# Altium project discovery_shield.PrjPcb
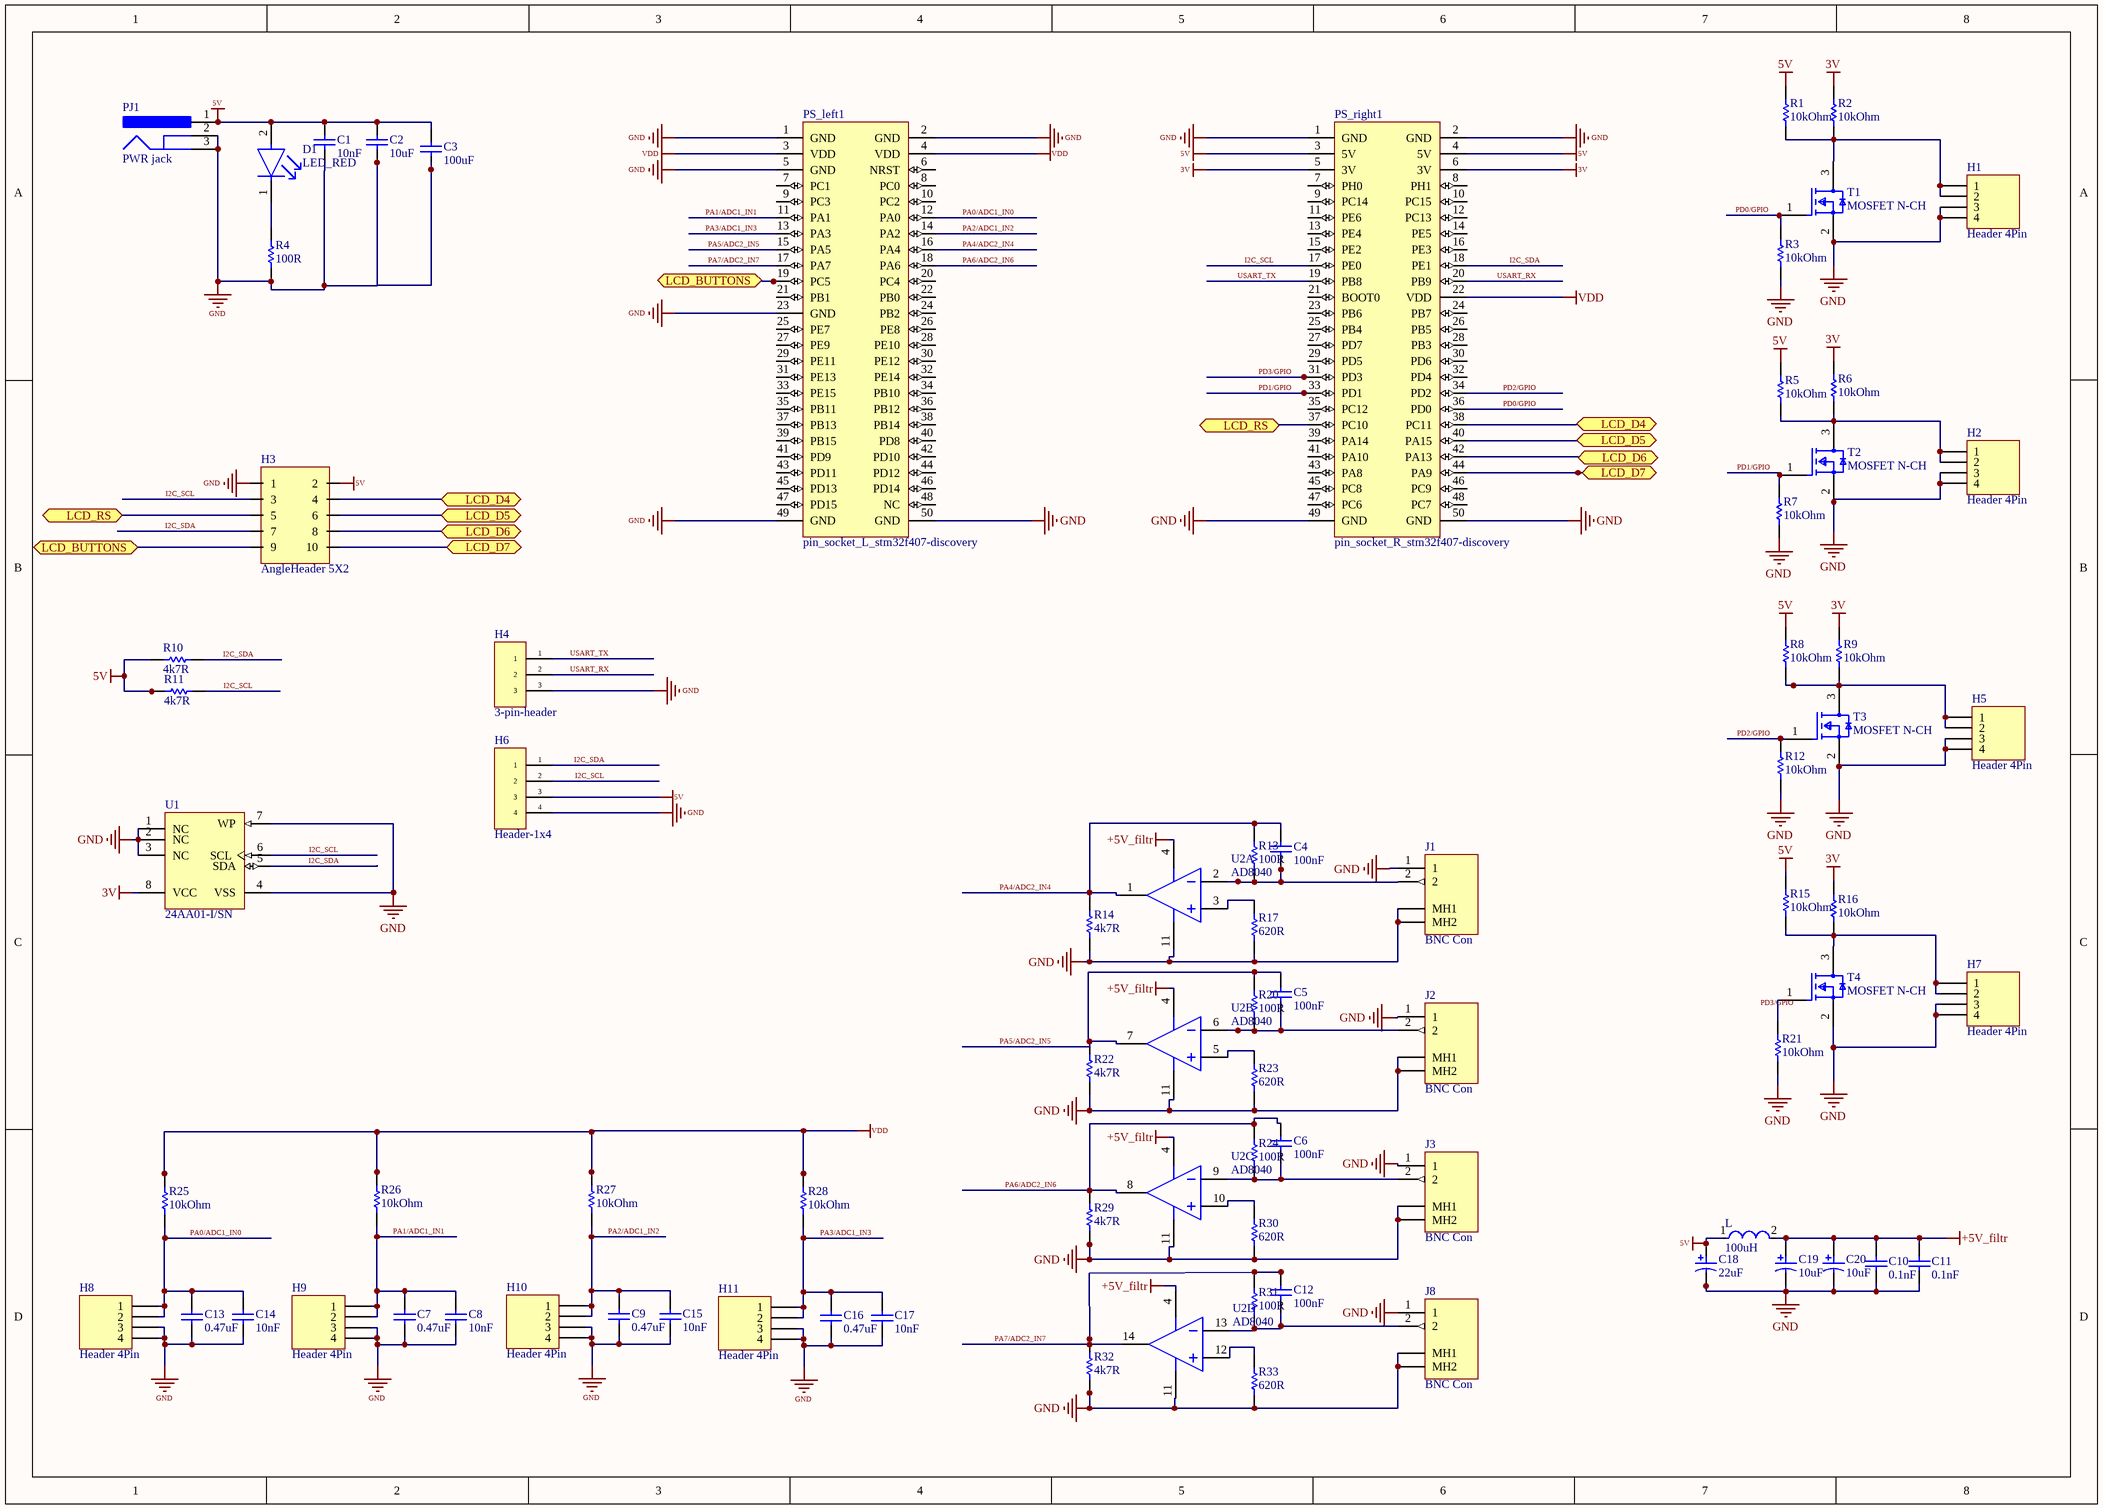
[diagram p0: discovery_shield.SchDoc]
1 sheet, 77 parts. Net scope: flat (ports and power ports of the same name join across sheets).
Board file: discovery_shield.PcbDoc

## Sheet discovery_shield.SchDoc
size A3

### Parts
C1  10nF  [CHIP CAPACITOR 0805]
C2  10uF  [CHIP CAPACITOR 0805]
C3  100uF  [CHIP CAPACITOR 0805]
C4  100nF  [CHIP CAPACITOR 0805]
C5  100nF  [CHIP CAPACITOR 0805]
C6  100nF  [CHIP CAPACITOR 0805]
C7  0.47uF  [CHIP CAPACITOR 0805]
C8  10nF  [CHIP CAPACITOR 0805]
C9  0.47uF  [CHIP CAPACITOR 0805]
C10  0.1nF  [CAP-CER-0.1nF]
C11  0.1nF  [CAP-CER-0.1nF]
C12  100nF  [CHIP CAPACITOR 0805]
C13  0.47uF  [CHIP CAPACITOR 0805]
C14  10nF  [CHIP CAPACITOR 0805]
C15  10nF  [CHIP CAPACITOR 0805]
C16  0.47uF  [CHIP CAPACITOR 0805]
C17  10nF  [CHIP CAPACITOR 0805]
C18  22uF  [TANTALUM_CAP_10uF]
C19  10uF  [TANTALUM_CAP_10uF]
C20  10uF  [TANTALUM_CAP_10uF]
D1  LED_RED  [LED 0805 RED]
H1  Header 4Pin  [CRIMP 3mm  4 pins]
H2  Header 4Pin  [CRIMP 3mm  4 pins]
H3  AngleHeader 5X2  [AngleHeader 5X2]
H4  3-pin-header  [Header-3-Pin]
H5  Header 4Pin  [CRIMP 3mm  4 pins]
H6  Header-1x4  [Header-1x4]
H7  Header 4Pin  [CRIMP 3mm  4 pins]
H8  Header 4Pin  [CRIMP 3mm  4 pins]
H9  Header 4Pin  [CRIMP 3mm  4 pins]
H10  Header 4Pin  [CRIMP 3mm  4 pins]
H11  Header 4Pin  [CRIMP 3mm  4 pins]
J1  BNC Con  [BNC_CONNECTOR_F]
J2  BNC Con  [BNC_CONNECTOR_F]
J3  BNC Con  [BNC_CONNECTOR_F]
J8  BNC Con  [BNC_CONNECTOR_F]
L  100uH  [SHIELDED-INDUCTOR-SMD]
PJ1  PWR jack  [DC SOCKET]
PS_left1  pin_socket_L_stm32f407-discovery  [pin_socket_L_discovery]
PS_right1  pin_socket_R_stm32f407-discovery  [pin_socket_R_discovery]
R1  10kOhm  [Chip Resistor 0805]
R2  10kOhm  [Chip Resistor 0805]
R3  10kOhm  [Chip Resistor 0805]
R4  100R  [Chip Resistor 0805]
R5  10kOhm  [Chip Resistor 0805]
R6  10kOhm  [Chip Resistor 0805]
R7  10kOhm  [Chip Resistor 0805]
R8  10kOhm  [Chip Resistor 0805]
R9  10kOhm  [Chip Resistor 0805]
R10  4k7R  [Chip Resistor 0805]
R11  4k7R  [Chip Resistor 0805]
R12  10kOhm  [Chip Resistor 0805]
R13  100R  [Chip Resistor 0805]
R14  4k7R  [Chip Resistor 0805]
R15  10kOhm  [Chip Resistor 0805]
R16  10kOhm  [Chip Resistor 0805]
R17  620R  [Chip Resistor 0805]
R20  100R  [Chip Resistor 0805]
R21  10kOhm  [Chip Resistor 0805]
R22  4k7R  [Chip Resistor 0805]
R23  620R  [Chip Resistor 0805]
R24  100R  [Chip Resistor 0805]
R25  10kOhm  [Chip Resistor 0805]
R26  10kOhm  [Chip Resistor 0805]
R27  10kOhm  [Chip Resistor 0805]
R28  10kOhm  [Chip Resistor 0805]
R29  4k7R  [Chip Resistor 0805]
R30  620R  [Chip Resistor 0805]
R31  100R  [Chip Resistor 0805]
R32  4k7R  [Chip Resistor 0805]
R33  620R  [Chip Resistor 0805]
T1  MOSFET N-CH  [MOSFET N-CH]
T2  MOSFET N-CH  [MOSFET N-CH]
T3  MOSFET N-CH  [MOSFET N-CH]
T4  MOSFET N-CH  [MOSFET N-CH]
U1  24AA01-I/SN  [EEPROM CHIP]
U2  AD8040  [AD8040]  (parts A,B,C,D of 4)

### Ports
LCD_BUTTONS (bidir), LCD_D4 (bidir), LCD_D5 (bidir), LCD_D6 (bidir), LCD_D7 (bidir), LCD_RS (bidir)

### Nets
3V: PS_right1.5(3V) PS_right1.6(3V) R2.2 R6.2 R9.2 R16.2 U1.8(VCC)
5V: C1.2 C2.1 C3.1 C18.1 D1.2(A) H3.6(2) H6.3 L.1 PJ1.1 PS_right1.3(5V) PS_right1.4(5V) R1.2 R5.2 R8.2 R10.1 R11.1 R15.2
+5V_filtr: C10.2 C11.2 C19.1 C20.1 L.2 U2.4(+VS)
GND: C1.1 C7.1 C8.1 C9.1 C10.1 C11.1 C13.1 C14.1 C15.1 C16.1 C17.1 C18.2 C19.2 C20.2 H1.3 H1.4 H2.3 H2.4 H3.1 H4.3 H5.3 H5.4 H6.4 H7.3 H7.4 H8.3 H8.4 H9.3 H9.4 H10.3 H10.4 H11.3 H11.4 J1.1 J1.MH1 J1.MH2 J2.1 J2.MH1 J2.MH2 J3.1 J3.MH1 J3.MH2 J8.1 J8.MH1 J8.MH2 PJ1.2 PJ1.3 PS_left1.1(GND) PS_left1.2(GND) PS_left1.5(GND) PS_left1.23(GND) PS_left1.49(GND) PS_left1.50(GND) PS_right1.1(GND) PS_right1.2(GND) PS_right1.49(GND) PS_right1.50(GND) R3.1 R4.2 R7.1 R12.1 R14.1 R17.1 R21.1 R22.1 R23.1 R29.1 R30.1 R32.1 R33.1 T1.2(S) T2.2(S) T3.2(S) T4.2(S) U1.1(NC) U1.2(NC) U1.3(NC) U1.4(VSS) U1.7(WP) U2.11(-VS)
VDD: PS_left1.3(VDD) PS_left1.4(VDD) PS_right1.22(VDD) R25.2 R26.2 R27.2 R28.2
I2C_SCL: H3.2(3) H6.2 PS_right1.17(PE0) R11.2 U1.6(SCL)
I2C_SDA: H3.4(7) H6.1 PS_right1.18(PE1) R10.2 U1.5(SDA)
PA0/ADC1_IN0: C13.2 C14.2 H8.1 H8.2 PS_left1.12(PA0) R25.1
PA1/ADC1_IN1: C7.2 C8.2 H9.1 H9.2 PS_left1.11(PA1) R26.1
PA2/ADC1_IN2: C9.2 C15.2 H10.1 H10.2 PS_left1.14(PA2) R27.1
PA3/ADC1_IN3: C16.2 C17.2 H11.1 H11.2 PS_left1.13(PA3) R28.1
PA4/ADC2_IN4: C4.2 PS_left1.16(PA4) R13.2 R14.2 U2.1(VOUT_1)
PA5/ADC2_IN5: C5.2 PS_left1.15(PA5) R20.2 R22.2 U2.7(VOUT_2)
PA6/ADC2_IN6: C6.2 PS_left1.18(PA6) R24.2 R29.2 U2.8(VOUT_3)
PA7/ADC2_IN7: C12.2 PS_left1.17(PA7) R31.2 R32.2 U2.14(VOUT_4)
PD0/GPIO: PS_right1.36(PD0) R3.2 T1.1(G)
PD1/GPIO: PS_right1.33(PD1) R7.2 T2.1(G)
PD2/GPIO: PS_right1.34(PD2) R12.2 T3.1(G)
PD3/GPIO: PS_right1.31(PD3) R21.2 T4.1(G)
USART_RX: H4.2 PS_right1.20(PB9)
USART_TX: H4.1 PS_right1.19(PB8)
NetC2_2: C2.2 C3.2
NetC4_1: C4.1 J1.2 R13.1 U2.2(-IN_1)
NetC5_1: C5.1 J2.2 R20.1 U2.6(-IN_2)
NetC6_1: C6.1 J3.2 R24.1 U2.9(-IN_3)
NetC12_1: C12.1 J8.2 R31.1 U2.13(-IN_4)
NetD1_1: D1.1(C) R4.1
NetH1_1: H1.1 H1.2 R1.1 R2.1 T1.3(D)
NetH2_1: H2.1 H2.2 R5.1 R6.1 T2.3(D)
NetH3_3: H3.3(5) PS_right1.37(PC10) ; port LCD_RS
NetH3_5: H3.5(9) PS_left1.19(PC5) ; port LCD_BUTTONS
NetH3_7: H3.7(4) PS_right1.38(PC11) ; port LCD_D4
NetH3_8: H3.8(6) PS_right1.40(PA15) ; port LCD_D5
NetH3_9: H3.9(8) PS_right1.42(PA13) ; port LCD_D6
NetH3_10: H3.10 PS_right1.44(PA9) ; port LCD_D7
NetH5_1: H5.1 H5.2 R8.1 R9.1 T3.3(D)
NetH7_1: H7.1 H7.2 R15.1 R16.1 T4.3(D)
NetR17_2: R17.2 U2.3(+IN_1)
NetR23_2: R23.2 U2.5(+IN_2)
NetR30_2: R30.2 U2.10(+IN_3)
NetR33_2: R33.2 U2.12(+IN_4)

Not connected (* = marked no-connect by the designer): PS_left1 6(NRST) 7(PC1) 8(PC0) 9(PC3) 10(PC2) 20(PC4) 21(PB1) 22(PB0) 24(PB2) 25(PE7) 26(PE8) 27(PE9) 28(PE10) 29(PE11) 30(PE12) 31(PE13) 32(PE14) 33(PE15) 34(PB10) 35(PB11) 36(PB12) 37(PB13) 38(PB14) 39(PB15) 40(PD8) 41(PD9) 42(PD10) 43(PD11) 44(PD12) 45(PD13) 46(PD14) 47(PD15) 48(NC); PS_right1 7(PH0) 8(PH1) 9(PC14) 10(PC15) 11(PE6) 12(PC13) 13(PE4) 14(PE5) 15(PE2) 16(PE3) 21(BOOT0) 23(PB6) 24(PB7) 25(PB4) 26(PB5) 27(PD7) 28(PB3) 29(PD5) 30(PD6) 32(PD4) 35(PC12) 39(PA14) 41(PA10) 43(PA8) 45(PC8) 46(PC9) 47(PC6) 48(PC7)

### Library data of the parts
C1 C8 C14 C15 C17 = Cap_0805_10nF: Manufacturer: Kemet; Part Number: C0805C103K5RACTU
C2 = Cap_0805_10uF: Cap 0805 10uF; Part Number: C0805C106K8PACTU; Manufacturer: Kemet
C3 = Cap_0805_100uF: Chip Capacitor, 100 uF, +/- 20%, 6.3 V, -55 to 85 degC, 0805 (2012 Metric), RoHS, Tape and Reel; Manufacturer: Murata; Voltage Rating (DC): 6.3V; Dielectric: X5R; RoHSCompliant: True; Case Code (Metric): 2012; Manufacturer URL: http://www.murata.com/; Length: 0.079inch; Mounting Technology: SurfaceMount; Datasheet URL: http://search.murata.co.jp/Ceramy/image/img/A01X/G101/ENG/GRM21BR60J107ME15-01.pdf; Max Operating Temperature: 85degC; Thickness: 0.057inch; Capacitance: 100uF; REACH SVHC: NoSVHC; Case Code (Imperial): 0805; Voltage Rating: 6.3V; Case/Package: 0805; Lead Free: LeadFree; Datasheet Version: 03/2016; Min Operating Temperature: -55degC; Package Reference: 805; Mount: SurfaceMount; Tolerance: 20%; Width: 0.049inch; Packaging: CutTape; Package Description: 2-Pin Surface Mount Device, Body 2 x 1.25 mm
C4-C6 C12 = Cap_0805_100nF: YAGEO - CC0805KRX7R7BB104 - SMD Multilayer Ceramic Capacitor, 0.1 µF, 16 V, 0805 [2012 Metric], ± 10%, X7R, CC Series; Voltage Rating: 16V; Insulation Resistance: 100GR; Supplier 1: Digi-Key; Manufacturer: Yageo; RoHS: Yes; Category: Ceramic Capacitors; Stock 1: 223308; Pricing 1: 1=0,12000, 10=0,08500, 50=0,04820, 100=0,03990, 500=0,02794, 1000=0,02314 (USD); Mount: Surface Mount; Case/Package: 0805; Number of Pins: 2; Case Code (Metric): 2012; Case Code (Imperial): 0805; Min Operating Temperature: -55°C; Max Operating Temperature: 125°C; Capacitance: 100nF; Tolerance: 10%; Packaging: Tape and Reel; Dielectric: X7R; Package Quantity: 1; Voltage Rating (DC): 16V; Termination: SMD/SMT; Voltage: 16V; Resistor Type: Ceramic; Length: 2mm; Width: 0.049inch; Height: 0.85mm; Depth: 1.25mm; Thickness: 0.033inch; Radiation Hardening: No; Lead Free: Lead Free; REACH SVHC: No SVHC; Halogen Free: Halogen Free; ComponentLink1URL: https://datasheet.ciiva.com/8034/1784427-8034017.pdf?src-supplier=Element14; ComponentLink1Description: https://datasheet.ciiva.com/8034/1784427-8034017.pdf?src-supplier=Element14; ComponentLink2URL: https://datasheet.ciiva.com/11786/0900766b80d84f1d-11786102.pdf?src-supplier=RSComponents; ComponentLink2Description: https://datasheet.ciiva.com/11786/0900766b80d84f1d-11786102.pdf?src-supplier=RSComponents; ComponentLink3URL: https://datasheet.ciiva.com/15189/getdatasheetpartid-314877-15189221.pdf?src-supplier=Verical; ComponentLink3Description: https://datasheet.ciiva.com/15189/getdatasheetpartid-314877-15189221.pdf?src-supplier=Verical; ComponentLink4URL: https://datasheet.ciiva.com/144/mlccorderingcode-144998.pdf?src-supplier=Digi-Key; ComponentLink4Description: https://datasheet.ciiva.com/144/mlccorderingcode-144998.pdf?src-supplier=Digi-Key; ComponentLink5URL: https://datasheet.ciiva.com/144/mlccorderingcode-144999.pdf?src-supplier=Digi-Key; ComponentLink5Description: https://datasheet.ciiva.com/144/mlccorderingcode-144999.pdf?src-supplier=Digi-Key; ComponentLink6URL: https://datasheet.ciiva.com/145/mlccorderingcode-145000.pdf?src-supplier=Digi-Key; ComponentLink6Description: https://datasheet.ciiva.com/145/mlccorderingcode-145000.pdf?src-supplier=Digi-Key; ComponentLink7URL: https://datasheet.ciiva.com/11465/upy-gphc-x7r-6-3v-to-50v-8-11465289.pdf?src-supplier=Avnet; ComponentLink7Description: https://datasheet.ciiva.com/11465/upy-gphc-x7r-6-3v-to-50v-8-11465289.pdf?src-supplier=Avnet; ComponentLink8URL: https://datasheet.ciiva.com/17436/upy-gphc-x7r-6-3v-to-50v-8-17436617.pdf?src-supplier=Avnet+Europe; ComponentLink8Description: https://datasheet.ciiva.com/17436/upy-gphc-x7r-6-3v-to-50v-8-17436617.pdf?src-supplier=Avnet+Europe; ComponentLink9URL: https://datasheet.ciiva.com/7978/1489800-7978204.pdf?src-supplier=Element14; ComponentLink9Description: https://datasheet.ciiva.com/7978/1489800-7978204.pdf?src-supplier=Element14; ComponentLink10URL: https://datasheet.ciiva.com/8034/1784427-8034015.pdf?src-supplier=Element14; ComponentLink10Description: https://datasheet.ciiva.com/8034/1784427-8034015.pdf?src-supplier=Element14; Manufacturer Part Number: CC0805KRX7R7BB104; Supplier Part Number 1: 311-1142-1-ND
C7 C9 C13 C16 = Cap_0805_0.47uF: Multilayer Ceramic Capacitors MLCC - SMD/SMT 10volts 0.47uF X7R 10%; Manufacturer: KEMET; Manufacturer Part Number: C0805C474K8RACTU; Capacitance: 470nF; Voltage Rating: 10V; Supplier 1: Digi-Key; RoHS: Yes; Category: Ceramic Capacitors; Stock 1: 149446; Pricing 1: 1=0,20000, 10=0,13600, 50=0,08160, 100=0,06900, 500=0,04720, 1000=0,04175 (USD); Mount: Surface Mount; Case/Package: 0805; Weight: 0.000194oz; Case Code (Metric): 2012; Case Code (Imperial): 0805; Dielectric Material: Ceramic; Min Operating Temperature: -55°C; Max Operating Temperature: 125°C; Package Quantity: 1; Tolerance: 10%; Packaging: Tape and Reel; Voltage Rating (DC): 10V; Dielectric: X7R; Termination: SMD/SMT; Length: 2mm; Height: 0.9mm; Width: 0.049inch; Thickness: 0.055inch; Depth: 1.25mm; Radiation Hardening: No; REACH SVHC: No SVHC; ComponentLink1URL: http://www.mouser.com/ds/2/212/KEM_C1002_X7R_SMD-1102033.pdf?src-supplier=Mouser; ComponentLink1Description: http://www.mouser.com/ds/2/212/KEM_C1002_X7R_SMD-1102033.pdf?src-supplier=Mouser; ComponentLink2URL: http://components.arrow.com/part/dataview/0323_00331026?src-supplier=Arrow+Europe; ComponentLink2Description: http://components.arrow.com/part/dataview/0323_00331026?src-supplier=Arrow+Europe; ComponentLink3URL: https://api.kemet.com/component-edge/download/datasheet/C0805C474K8RACTU.pdf?src-supplier=Digi-Key; ComponentLink3Description: https://api.kemet.com/component-edge/download/datasheet/C0805C474K8RACTU.pdf?src-supplier=Digi-Key; ComponentLink4URL: https://search.kemet.com/component-edge/download/datasheet/C0805C474K8RACTU.pdf?src-supplier=Digi-Key; ComponentLink4Description: https://search.kemet.com/component-edge/download/datasheet/C0805C474K8RACTU.pdf?src-supplier=Digi-Key; ComponentLink5URL: http://capacitoredge.kemet.com/capedge2/DataSheet?pn=C0805C474K8RACTU&src-supplier=Avnet; ComponentLink5Description: http://capacitoredge.kemet.com/capedge2/DataSheet?pn=C0805C474K8RACTU&src-supplier=Avnet; ComponentLink6URL: http://components.arrow.com/part/dataview/2092505S3976494N7429?src-supplier=Arrow; ComponentLink6Description: http://components.arrow.com/part/dataview/2092505S3976494N7429?src-supplier=Arrow; Supplier Part Number 1: 399-9247-1-ND
C10 C11 = 0.1nF: CERAMIC CAPACITOR 100PF 200V, C0G, 10%, 0805, FULL REEL; Product Range:-; Capacitance:100pF; Capacitance Tolerance: 10%; Dielectric Characteristic:C0G / NP0; Voltage Rating:200V; Ceramic Capacitor Case:0805 [2012 Metric] ;RoHS Compliant: Yes; Manufacturer: Kyocera AVX; Manufacturer Part Number: 08052A101KAT2A; Supplier 1: Digi-Key; RoHS: Yes; Category: Ceramic Capacitors; Stock 1: 19500; Pricing 1: 1=0,17000, 10=0,12200, 50=0,06940, 100=0,05740, 500=0,04026, 1000=0,03333 (USD); Mount: Surface Mount; Case/Package: 0805; Number of Pins: 2; Case Code (Metric): 2012; Case Code (Imperial): 0805; Min Operating Temperature: -55°C; Max Operating Temperature: 125°C; Capacitance: 100pF; Tolerance: 10%; Package Quantity: 12000; Voltage Rating: 200V; Packaging: Tape and Reel; Voltage Rating (DC): 200V; Dielectric: C0G; Termination: SMD/SMT; Dissipation Factor: 10%; Length: 2.01mm; Width: 0.049inch; Height: 0.94mm; Thickness: 0.037inch; Depth: 1.25mm; Radiation Hardening: No; ComponentLink1URL: https://datasheet.ciiva.com/206/ccog-206194.pdf?src-supplier=Digi-Key; ComponentLink1Description: https://datasheet.ciiva.com/206/ccog-206194.pdf?src-supplier=Digi-Key; ComponentLink2URL: https://datasheet.ciiva.com/5424/ccog-243403-5424072.pdf?src-supplier=Mouser; ComponentLink2Description: https://datasheet.ciiva.com/5424/ccog-243403-5424072.pdf?src-supplier=Mouser; Supplier Part Number 1: 478-08052A101KAT2ACT-ND
C18-C20 = 10uF_Tantalum_Cap: CAPACITOR, CASE A, 10UF, 10V; Product Range:KEMET - T491 Series; Capacitance:10µF; Capacitance Tolerance:± 10%; Voltage Rating:10V; Capacitor Case Style:1206 [3216 Metric]; Manufacturer Size Code:A; Operating Temperature Max:125°C; ;RoHS Compliant: Yes; Manufacturer: KEMET; Manufacturer Part Number: T491A106K010AT; ESR (Equivalent Series Resistance): 4R; Leakage Current: 1uA; Polarity: Polar; Dissipation Factor: 6%; Life (Hours): 2000Hour; Ripple Current: 137mA; Supplier 1: Digi-Key; RoHS: Yes; Category: Tantalum Capacitors; Stock 1: 2242457; Pricing 1: 1=0.37000, 10=0.25400, 50=0.17760, 100=0.15230, 500=0.11420, 1000=0.09644 (USD); Mount: Surface Mount,PCB; Case/Package: 1206; Case Code (Metric): 3216; Case Code (Imperial): 1206; Dielectric Material: Tantalum; Min Operating Temperature: -55°C; Max Operating Temperature: 125°C; Capacitance: 10uF; Voltage Rating: 10V; Tolerance: 10%; Packaging: Tape and Reel; Package Quantity: 2000; Voltage Rating (DC): 10V; Termination: SMD/SMT; Voltage: 10V; Features: General Purpose; Length: 3.2mm; Width: 0.063inch; Height: 1.6mm; Height - Seated (Max): 0.071inch; Depth: 1.6mm; REACH SVHC: No SVHC; Lead Free: Lead Free; RoHS Compliant: Yes; Supplier Part Number 1: 399-3684-1-ND
D1 = LED RED: LED RED CLEAR CHIP SMD; Forward Current: 30mA; Test Current: 10mA; Number of Elements: 1; Viewing Angle: 130°; Dominant Wavelength: 621nm; Forward Voltage: 2V; Lens Style: Diffused; Power Rating: 100mW; Reverse Voltage: 5V; Wavelength: 630nm; Luminous Intensity: 6mcd; Lens Color: Colorless; Case/Package: 1206; Case Code (Imperial): 1206; Package Quantity: 1; Lead Free: Lead Free; Case Code (Metric): 3216; Height: 1.1mm; Lens Transparency: Clear; Mount: Surface Mount; Depth: 1.6mm; Number of LEDs: 1; Power Dissipation: 100mW; Max Operating Temperature: 85°C; Width: 1.6mm; Color: Red; Number of Pins: 2; Min Operating Temperature: -55°C; Packaging: Tape and Reel; Radiation Hardening: No; Illumination Color: Red; Length: 3.2mm
H1 H2 H5 H7-H11 = CRIMP 3mm 4PIN
H4 = Header-1x3: CONN HEADER VERT 3POS 2MM; Manufacturer: 3M; Manufacturer Part Number: 951103-8622-AR; Number of Positions: 3; Connector Type: Male Pin; Gender: Male; Current Rating: 1A; Voltage Rating: 1kV; Contact Resistance: 20mR; Contact Post Length: 2.8mm; Supplier 1: Digi-Key; RoHS: Yes; Category: Headers and Wire Housings; Stock 1: 1610; Pricing 1: 1=0,29000, 10=0,27500, 25=0,23560, 50=0,20020, 100=0,19230, 250=0,17264, 500=0,16480 (USD); Mount: Through Hole; Color: Black; Contact Plating: Gold; Contact Material: Copper Alloy,Copper; Housing Material: Thermoplastic; Housing Color: Black; Min Operating Temperature: -25°C; Max Operating Temperature: 105°C; Number of Rows: 1; Packaging: Bulk; Termination: Solder; Number of Contacts: 3; Package Quantity: 3000; Contact Gender: Male; Orientation: Straight; Max Current Rating: 1A; Length: 6mm; Pitch: 2mm; Contact Mating Length: 0.173inch; Depth: 2mm; REACH SVHC: Unknown; ComponentLink1URL: https://datasheet.ciiva.com/730/ts2156-730432.pdf?src-supplier=Digi-Key; ComponentLink1Description: https://datasheet.ciiva.com/730/ts2156-730432.pdf?src-supplier=Digi-Key; ComponentLink2URL: https://datasheet.ciiva.com/14622/70237750-14622743.pdf?src-supplier=Allied+Electronics; ComponentLink2Description: https://datasheet.ciiva.com/14622/70237750-14622743.pdf?src-supplier=Allied+Electronics; ComponentLink3URL: https://datasheet.ciiva.com/7997/ts2156-7997244.pdf?src-supplier=Element14; ComponentLink3Description: https://datasheet.ciiva.com/7997/ts2156-7997244.pdf?src-supplier=Element14; Supplier Part Number 1: 3M156413-03-ND
J1-J3 J8 = BNC_Female: Female Connector, Pitch 2.54 mm, 1 x 2 Position, Height 15.8 mm, Tail Length 3.8 mm, / -55 to 85 degC, RoHS, Bulk; Manufacturer: TE Connectivity; Connector Body Style: RightAngleJack; Frequency Max: 4GHz; Coaxial Termination: Solder; Connector Mounting: PCBMount; SVHC: ToBeAdvised; Connector Type: BNCCoaxial; Impedance: 50ohm; Coaxial Cable Types: -; Manufacturer URL: http://www.te.com/; Package Reference: 1-1337543-0; Product Range: -; Datasheet URL: http://www.te.com/commerce/DocumentDelivery/DDEController?Action=showdoc&DocId=Customer+Drawing%7F1337543%7FG%7Fpdf%7FEnglish%7FENG_CD_1337543_G.pdf%7F1-1337543-0; Contact Plating: GoldPlatedContacts; Mounting Technology: ThroughHole; Package Description: Female Connector, Pitch 2.54 mm, 1 x 2 Position, Height 15.8 mm, Tail Length 3.8 mm; Contact Material: Brass; Datasheet Version: Rev. G, 12/2012
L = Shielded_Inductor_SMD: BOURNS         SRR1210-680M.             INDUCTOR, SHIELDED, 100UH, 2.7A, SMD; Core Material: Ferrite; Inductance Tolerance: 20%; Self Resonant Frequency: 3.8MHz; Current Rating: 3A; DC Resistance (DCR): 102mR; Test Frequency: 100kHz; Q Factor: 12; Description: BOURNS         SRR1210-680M.             INDUCTOR, SHIELDED, 68UH, 2.7A, SMD; Supplier 1: Digi-Key; Manufacturer: Bourns; Manufacturer Part Number: SRR1210-680M; RoHS: Yes; Category: Fixed Inductors; Pricing 1: 1=1.27000, 10=1.18000, 25=1.08880, 50=0.90760, 100=0.85300 (USD); Mount: Surface Mount; Case/Package: 1210; Min Operating Temperature: -40°C; Max Operating Temperature: 125°C; Inductance: 100uH; Tolerance: 20%; Packaging: Tape and Reel; Shielding: Shielded; Package Quantity: 250; Max DC Current: 3A; Termination: SMD/SMT; Series: SRR1210; Saturation Current: 2.7A; RMS Current (Irms): 3A; Resistor Type: Wirewound; DC Current: 3A; Length: 12mm; Width: 0.472inch; Height: 10mm; Height - Seated (Max): 0.394inch; Depth: 12.5mm; REACH SVHC: No SVHC; RoHS Compliant: Yes; Military Standard: Not; ComponentLink1URL: https://datasheet.ciiva.com/11799/0900766b80f2b72a-11799858.pdf?src-supplier=RSComponents; ComponentLink1Description: https://datasheet.ciiva.com/11799/0900766b80f2b72a-11799858.pdf?src-supplier=RSComponents; ComponentLink2URL: https://datasheet.ciiva.com/48684/srr1210-48684857.pdf?src-supplier=Avnet; ComponentLink2Description: https://datasheet.ciiva.com/48684/srr1210-48684857.pdf?src-supplier=Avnet; ComponentLink3URL: https://datasheet.ciiva.com/17285/srr1210-17285962.pdf?src-supplier=Avnet+Europe; ComponentLink3Description: https://datasheet.ciiva.com/17285/srr1210-17285962.pdf?src-supplier=Avnet+Europe; ComponentLink4URL: https://datasheet.ciiva.com/6697/srr1210-6697611.pdf?src-supplier=Digi-Key; ComponentLink4Description: https://datasheet.ciiva.com/6697/srr1210-6697611.pdf?src-supplier=Digi-Key; ComponentLink5URL: https://datasheet.ciiva.com/46437/1430851-46437356.pdf?src-supplier=Element14; ComponentLink5Description: https://datasheet.ciiva.com/46437/1430851-46437356.pdf?src-supplier=Element14; ComponentLink6URL: https://datasheet.ciiva.com/6697/srr1210-6697613.pdf?src-supplier=Digi-Key; ComponentLink6Description: https://datasheet.ciiva.com/6697/srr1210-6697613.pdf?src-supplier=Digi-Key; ComponentLink7URL: https://datasheet.ciiva.com/46437/1430851-46437357.pdf?src-supplier=Element14; ComponentLink7Description: https://datasheet.ciiva.com/46437/1430851-46437357.pdf?src-supplier=Element14; ComponentLink8URL: https://datasheet.ciiva.com/6697/srr1210-6697615.pdf?src-supplier=Digi-Key; ComponentLink8Description: https://datasheet.ciiva.com/6697/srr1210-6697615.pdf?src-supplier=Digi-Key; Supplier Part Number 1: SRR1210-680MCT-ND
PJ1 = DC_socket: CONN PWR JACK 2.5X5.5MM SOLDER; Manufacturer: CUI; Manufacturer Part Number: PJ-102B; Shielding: Unshielded; Current Rating: 2.5A; Gender: Male; Voltage Rating: 24V; Number of Conductors: 2; Insulation Resistance: 100MR; Supplier 1: Digi-Key; RoHS: Yes; Category: Connectors; Stock 1: 26389; Pricing 1: 1=0,64000, 10=0,60000, 25=0,54000, 50=0,48000, 100=0,46000, 250=0,42000, 500=0,40000, 1000=0,33000, 2500=0,30000 (USD); Mount: Through Hole; Contact Plating: Nickel; Color: Black; Contact Material: Copper; Housing Color: Black; Housing Material: Thermoplastic; Min Operating Temperature: -25°C; Max Operating Temperature: 85°C; Packaging: Bulk; Package Quantity: 280; Termination: Through Hole; Orientation: Horizontal; Connector Type: Jack; Contact Gender: Male; Diameter: 2.5mm; Lead Free: Lead Free; Flammability Rating: UL94 V-0; ComponentLink1URL: http://www.mouser.com/ds/2/670/PJ-102B-524146.pdf?src-supplier=Mouser; ComponentLink1Description: http://www.mouser.com/ds/2/670/PJ-102B-524146.pdf?src-supplier=Mouser; ComponentLink2URL: http://www.cui.com/Product/Resource/FuturePDF/PJ-102B.pdf?src-supplier=Future+Electronics; ComponentLink2Description: http://www.cui.com/Product/Resource/FuturePDF/PJ-102B.pdf?src-supplier=Future+Electronics; ComponentLink3URL: https://www.cui.com/product/resource/digikeypdf/pj-102b.pdf?src-supplier=Digi-Key; ComponentLink3Description: https://www.cui.com/product/resource/digikeypdf/pj-102b.pdf?src-supplier=Digi-Key; Supplier Part Number 1: CP-102B-ND
PS_left1 = pin_socket_L_discovery: Socket for STM32F407-discovery pinout
PS_right1 = pin_socket_R_discovery: Socket for STM32F407-discovery pinout
R1-R3 R5-R9 R12 R15 R16 R21 R25-R28 = Res_0805_10kOhm: Chip Resistor, 10 KOhm, +/- 1%, 0.125 W, -55 to 155 degC, 0805 (2012 Metric), RoHS, Tape and Reel; Manufacturer: Yageo; Voltage Rating: 150 V; Mount: Surface Mount; ComponentLink1Description: Manufacturer URL; ComponentLink2URL: http://www.yageo.com/documents/recent/PYu-RC_Group_51_RoHS_L_04.pdf; Pins: 2; Length: 2 mm; Min Operating Temperature: -55 degC; Height: 0.5 mm; Mounting Technology: Surface Mount; RoHSCompliant: true; REACH SVHC: No SVHC; ComponentLink1URL: http://www.yageo.com/; Max Operating Temperature: 155 degC; PackageReference: 0805; DatasheetVersion: Rev. 4, 02/2016; Package Quantity: 5000; Packaging: Tape and Reel; ComponentLink2Description: Datasheet; PackageDescription: 2-Pin Surface Mounted Device, Body 2 x 1.25 mm
R4 R13 R20 R24 R31 = Res_0805_100Ohm: Manufacturer: Yageo; Part Number: RT0805DRD07100RL
R10 R11 R14 R22 R29 R32 = Res_0805_4k7Ohm: Chip Resistor in 0805 package
R17 R23 R30 R33 = Res_0805_620Ohm: Res Thin Film 0805 620 Ohm 0.1% 0.125W(1/8W) ±25ppm/C Molded SMD Automotive Punched T/R; Manufacturer: Panasonic; Manufacturer Part Number: ERA-6AEB621V; Temperature Coefficient: 25ppm/°C; Power Rating: 125mW; Voltage Rating (DC): 100V; Supplier 1: Digi-Key; RoHS: Yes; Category: Chip SMD Resistors; Stock 1: 1336; Pricing 1: 1=0,31000, 10=0,26200, 100=0,10230, 1000=0,04284, 2500=0,03927 (USD); Mount: Surface Mount; Case/Package: 0805; Number of Pins: 2; Case Code (Metric): 2012; Case Code (Imperial): 0805; Contact Plating: Tin; Weight: 0.000194oz; Min Operating Temperature: -55°C; Max Operating Temperature: 155°C; Tolerance: 0.1%; Packaging: Tape and Reel; Resistance: 620R; Resistor Type: Thin Film; Package Quantity: 5000; Number of Terminations: 2; Max Power Dissipation: 125mW; Termination: SMD/SMT; Voltage Rating: 100V; Features: Automotive AEC-Q200; Length: 2mm; Width: 0.049inch; Height: 0.024inch; Depth: 1.25mm; Radiation Hardening: No; Lead Free: Lead Free; Military Standard: Not; REACH SVHC: No SVHC; ComponentLink1URL: https://datasheet.ciiva.com/29184/452957-da-01-en-widerstand-0805-era-29184095.pdf?src-supplier=Conrad; ComponentLink1Description: https://datasheet.ciiva.com/29184/452957-da-01-en-widerstand-0805-era-29184095.pdf?src-supplier=Conrad; ComponentLink2URL: https://datasheet.ciiva.com/5915/485442-5915222.pdf?src-supplier=Farnell; ComponentLink2Description: https://datasheet.ciiva.com/5915/485442-5915222.pdf?src-supplier=Farnell; ComponentLink3URL: https://datasheet.ciiva.com/5915/485442-5915223.pdf?src-supplier=Farnell; ComponentLink3Description: https://datasheet.ciiva.com/5915/485442-5915223.pdf?src-supplier=Farnell; ComponentLink4URL: https://datasheet.ciiva.com/5915/485442-5915224.pdf?src-supplier=Farnell; ComponentLink4Description: https://datasheet.ciiva.com/5915/485442-5915224.pdf?src-supplier=Farnell; ComponentLink5URL: https://datasheet.ciiva.com/22699/485442-22699418.pdf?src-supplier=Element14; ComponentLink5Description: https://datasheet.ciiva.com/22699/485442-22699418.pdf?src-supplier=Element14; ComponentLink6URL: https://datasheet.ciiva.com/9180/aoa0000ce26-9180731.pdf?src-supplier=Avnet; ComponentLink6Description: https://datasheet.ciiva.com/9180/aoa0000ce26-9180731.pdf?src-supplier=Avnet; ComponentLink7URL: https://datasheet.ciiva.com/30251/54aoa0000ce26-30251500.pdf?src-supplier=Onlinecomponents.com; ComponentLink7Description: https://datasheet.ciiva.com/30251/54aoa0000ce26-30251500.pdf?src-supplier=Onlinecomponents.com; ComponentLink8URL: https://datasheet.ciiva.com/48536/era-eng-tds-48536828.pdf?src-supplier=Distrelec; ComponentLink8Description: https://datasheet.ciiva.com/48536/era-eng-tds-48536828.pdf?src-supplier=Distrelec; Supplier Part Number 1: P620DACT-ND
T1-T4 = MOSFET N-CH: Trans MOSFET N-CH 30V 5.7A 3-Pin SOT-23; Manufacturer: Alpha & Omega Semiconductor; Manufacturer Part Number: AO3400A; Max Power Dissipation: 1.4W; Input Capacitance: 630pF; Gate to Source Voltage (Vgs): 12V; Rds On Max: 26.5mR; Number of Elements: 1; Supplier 1: Digi-Key; RoHS: Yes; Category: MOSFETs; Pricing 1: 1=0,36000, 10=0,27500, 25=0,24760, 100=0,13050, 500=0,11566, 1000=0,09000 (USD); Mount: Surface Mount; Case/Package: SOT-23; Number of Pins: 3; Min Operating Temperature: -55°C; Max Operating Temperature: 150°C; Packaging: Tape and Reel; Drain to Source Voltage (Vdss): 30V; Continuous Drain Current (ID): 5.7A; Power Dissipation: 1.4W; Radiation Hardening: No; Lead Free: Lead Free; ComponentLink1URL: https://datasheet.ciiva.com/940/ao3400a-940739.pdf?src-supplier=Digi-Key; ComponentLink1Description: https://datasheet.ciiva.com/940/ao3400a-940739.pdf?src-supplier=Digi-Key; ComponentLink2URL: https://datasheet.ciiva.com/26906/getdatasheetpartid-64438-26906526.pdf?src-supplier=Verical; ComponentLink2Description: https://datasheet.ciiva.com/26906/getdatasheetpartid-64438-26906526.pdf?src-supplier=Verical; ComponentLink3URL: https://datasheet.ciiva.com/940/ao3400a-940740.pdf?src-supplier=Digi-Key; ComponentLink3Description: https://datasheet.ciiva.com/940/ao3400a-940740.pdf?src-supplier=Digi-Key; ComponentLink4URL: https://datasheet.ciiva.com/940/ao3400a-940741.pdf?src-supplier=Digi-Key; ComponentLink4Description: https://datasheet.ciiva.com/940/ao3400a-940741.pdf?src-supplier=Digi-Key; Supplier Part Number 1: 785-1000-1-ND
U1 = EEPROM_1Kbit: 1Kbit, 400kHz, 1.8V, I2C Serial EEPROM, 8-Pin SOIC 150mil, Industrial Temperature; PackageDescription: 8-Lead Plastic Small Outline (SN) - Narrow, 3.90mm Body [SOIC]; DatasheetVersion: revJ, Jan-2009; PackageVersion: revBB, Aug-2009; Code_IPC: SOIC127P600-8; Code_JEDEC: MS-012; PackageReference: SOIC-SN8
U2 = AD8040ARZ: Quad Channel RRIO Operational Amplifier, 125 MHz BW, 62 V/us SR, Industrial, 14-pin SOIC (R-14), Tube; Manufacturer: Analog Devices; Slew Rate: 62V/us; Amplifiers Per Package: 4; V Span Max: 12V; Input Offset Voltage: 1.6mV; Small Signal Bandwidth: 125MHz; Iq/Amp: 1.5mA; V Span Min: 2.7V; Input Bias Current: 700nA; ComponentLink2Description: Datasheet; ComponentLink3Description: Package Specification; ComponentLink1Description: Manufacturer URL; Generic Part Number: AD8040; ComponentLink2URL: http://www.analog.com/static/imported-files/data_sheets/AD8029_8030_8040.pdf; PackageDescription: 14-Pin Standard Small Outline Package, Body 8.65 x 3.9 mm, Pitch 1.27 mm; Code_JEDEC: MS-012-AB; ComponentLink1URL: http://www.analog.com/en/index.html; PartNumber: AD8040ARZ; DatasheetVersion: Rev. B; PackageVersion: 060606-A; ComponentLink3URL: http://www.analog.com/static/imported-files/packages/PKG_PDF/SOIC_Narrow%20(R)/R_14.pdf; Mounting Technology: Surface Mount; PackageReference: R-14